# Altium schematic sheet 7.RK3588_DDR_Controler.SchDoc
size A3; SheetNumber: 7; SheetTotal: 21
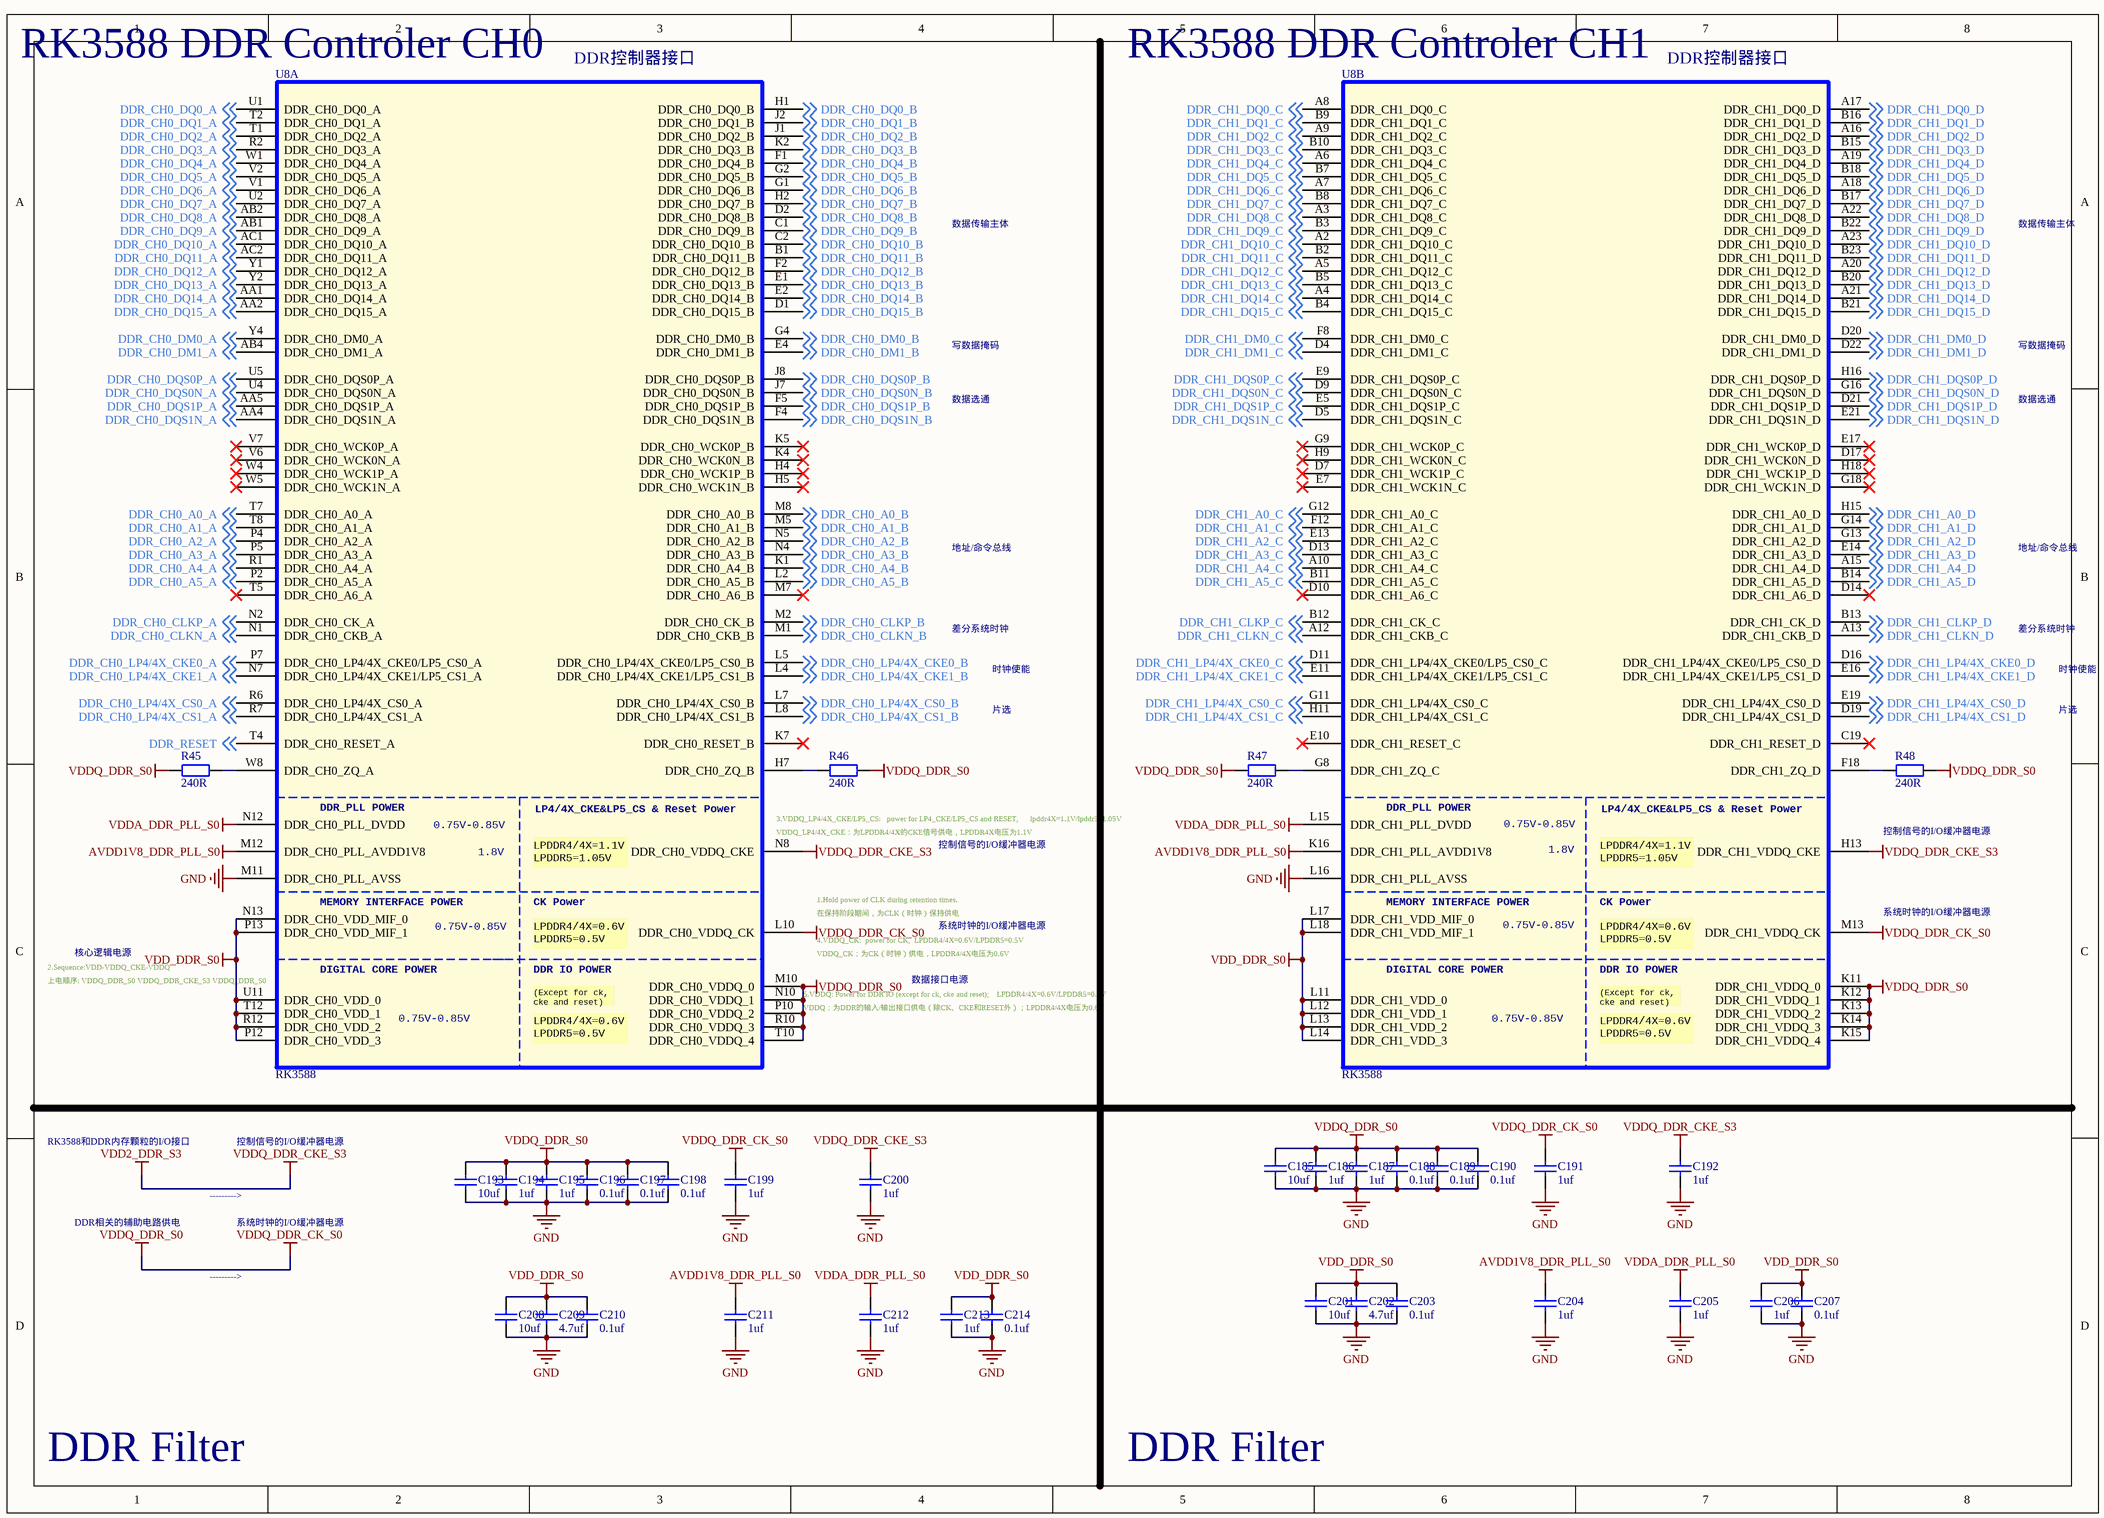
[diagram p0: 7.RK3588_DDR_Controler.SchDoc]

## Parts
C185  10uf  [C0402_L]
C186  1uf  [C0201_L]
C187  1uf  [C0201_L]
C188  0.1uf  [C0201_L]
C189  0.1uf  [C0201_L]
C190  0.1uf  [C0201_L]
C191  1uf  [C0201_L]
C192  1uf  [C0201_L]
C193  10uf  [C0402_L]
C194  1uf  [C0201_L]
C195  1uf  [C0201_L]
C196  0.1uf  [C0201_L]
C197  0.1uf  [C0201_L]
C198  0.1uf  [C0201_L]
C199  1uf  [C0201_L]
C200  1uf  [C0201_L]
C201  10uf  [C0402_L]
C202  4.7uf  [C0201_L]
C203  0.1uf  [C0201_L]
C204  1uf  [C0201_L]
C205  1uf  [C0201_L]
C206  1uf  [C0201_L]
C207  0.1uf  [C0201_L]
C208  10uf  [C0201_L]
C209  4.7uf  [C0201_L]
C210  0.1uf  [C0201_L]
C211  1uf  [C0201_L]
C212  1uf  [C0201_L]
C213  1uf  [C0201_L]
C214  0.1uf  [C0201_L]
R45  240R  [R0201_L]
R46  240R  [R0201_L]
R47  240R  [R0201_L]
R48  240R  [R0201_L]
U8  RK3588  [BGA1088_23R00X23R00X2R00]  (parts A,B of 26)

## Nets
AVDD1V8_DDR_PLL_S0: C204.2 C211.2 U8.K16(DDR_CH1_PLL_AVDD1V8) U8.M12(DDR_CH0_PLL_AVDD1V8)
GND: C185.1 C186.1 C187.1 C188.1 C189.1 C190.1 C191.1 C192.1 C193.1 C194.1 C195.1 C196.1 C197.1 C198.1 C199.1 C200.1 C201.1 C202.1 C203.1 C204.1 C205.1 C206.1 C207.1 C208.1 C209.1 C210.1 C211.1 C212.1 C213.1 C214.1 U8.L16(DDR_CH1_PLL_AVSS) U8.M11(DDR_CH0_PLL_AVSS)
VDD2_DDR_S3: C192.2 C200.2 U8.H13(DDR_CH1_VDDQ_CKE) U8.N8(DDR_CH0_VDDQ_CKE)  [also labelled VDDQ_DDR_CKE_S3]
VDD_DDR_S0: C201.2 C202.2 C203.2 C206.2 C207.2 C208.2 C209.2 C210.2 C213.2 C214.2 U8.L11(DDR_CH1_VDD_0) U8.L12(DDR_CH1_VDD_1) U8.L13(DDR_CH1_VDD_2) U8.L14(DDR_CH1_VDD_3) U8.L17(DDR_CH1_VDD_MIF_0) U8.L18(DDR_CH1_VDD_MIF_1) U8.N13(DDR_CH0_VDD_MIF_0) U8.P12(DDR_CH0_VDD_3) U8.P13(DDR_CH0_VDD_MIF_1) U8.R12(DDR_CH0_VDD_2) U8.T12(DDR_CH0_VDD_1) U8.U11(DDR_CH0_VDD_0)
VDDA_DDR_PLL_S0: C205.2 C212.2 U8.L15(DDR_CH1_PLL_DVDD) U8.N12(DDR_CH0_PLL_DVDD)
VDDQ_DDR_CK_S0: C185.2 C186.2 C187.2 C188.2 C189.2 C190.2 C191.2 C193.2 C194.2 C195.2 C196.2 C197.2 C198.2 C199.2 R45.1 R46.1 R47.1 R48.1 U8.K11(DDR_CH1_VDDQ_0) U8.K12(DDR_CH1_VDDQ_1) U8.K13(DDR_CH1_VDDQ_2) U8.K14(DDR_CH1_VDDQ_3) U8.K15(DDR_CH1_VDDQ_4) U8.L10(DDR_CH0_VDDQ_CK) U8.M10(DDR_CH0_VDDQ_0) U8.M13(DDR_CH1_VDDQ_CK) U8.N10(DDR_CH0_VDDQ_1) U8.P10(DDR_CH0_VDDQ_2) U8.R10(DDR_CH0_VDDQ_3) U8.T10(DDR_CH0_VDDQ_4)  [also labelled VDDQ_DDR_S0]
DDR_CH0_A0_A: U8.T7(DDR_CH0_A0_A) ; off-sheet DDR_CH0_A0_A
DDR_CH0_A0_B: U8.M8(DDR_CH0_A0_B) ; off-sheet DDR_CH0_A0_B
DDR_CH0_A1_A: U8.T8(DDR_CH0_A1_A) ; off-sheet DDR_CH0_A1_A
DDR_CH0_A1_B: U8.M5(DDR_CH0_A1_B) ; off-sheet DDR_CH0_A1_B
DDR_CH0_A2_A: U8.P4(DDR_CH0_A2_A) ; off-sheet DDR_CH0_A2_A
DDR_CH0_A2_B: U8.N5(DDR_CH0_A2_B) ; off-sheet DDR_CH0_A2_B
DDR_CH0_A3_A: U8.P5(DDR_CH0_A3_A) ; off-sheet DDR_CH0_A3_A
DDR_CH0_A3_B: U8.N4(DDR_CH0_A3_B) ; off-sheet DDR_CH0_A3_B
DDR_CH0_A4_A: U8.R1(DDR_CH0_A4_A) ; off-sheet DDR_CH0_A4_A
DDR_CH0_A4_B: U8.K1(DDR_CH0_A4_B) ; off-sheet DDR_CH0_A4_B
DDR_CH0_A5_A: U8.P2(DDR_CH0_A5_A) ; off-sheet DDR_CH0_A5_A
DDR_CH0_A5_B: U8.L2(DDR_CH0_A5_B) ; off-sheet DDR_CH0_A5_B
DDR_CH0_CLKN_A: U8.N1(DDR_CH0_CKB_A) ; off-sheet DDR_CH0_CLKN_A
DDR_CH0_CLKN_B: U8.M1(DDR_CH0_CKB_B) ; off-sheet DDR_CH0_CLKN_B
DDR_CH0_CLKP_A: U8.N2(DDR_CH0_CK_A) ; off-sheet DDR_CH0_CLKP_A
DDR_CH0_CLKP_B: U8.M2(DDR_CH0_CK_B) ; off-sheet DDR_CH0_CLKP_B
DDR_CH0_DM0_A: U8.Y4(DDR_CH0_DM0_A) ; off-sheet DDR_CH0_DM0_A
DDR_CH0_DM0_B: U8.G4(DDR_CH0_DM0_B) ; off-sheet DDR_CH0_DM0_B
DDR_CH0_DM1_A: U8.AB4(DDR_CH0_DM1_A) ; off-sheet DDR_CH0_DM1_A
DDR_CH0_DM1_B: U8.E4(DDR_CH0_DM1_B) ; off-sheet DDR_CH0_DM1_B
DDR_CH0_DQ0_A: U8.U1(DDR_CH0_DQ0_A) ; off-sheet DDR_CH0_DQ0_A
DDR_CH0_DQ0_B: U8.H1(DDR_CH0_DQ0_B) ; off-sheet DDR_CH0_DQ0_B
DDR_CH0_DQ1_A: U8.T2(DDR_CH0_DQ1_A) ; off-sheet DDR_CH0_DQ1_A
DDR_CH0_DQ1_B: U8.J2(DDR_CH0_DQ1_B) ; off-sheet DDR_CH0_DQ1_B
DDR_CH0_DQ2_A: U8.T1(DDR_CH0_DQ2_A) ; off-sheet DDR_CH0_DQ2_A
DDR_CH0_DQ2_B: U8.J1(DDR_CH0_DQ2_B) ; off-sheet DDR_CH0_DQ2_B
DDR_CH0_DQ3_A: U8.R2(DDR_CH0_DQ3_A) ; off-sheet DDR_CH0_DQ3_A
DDR_CH0_DQ3_B: U8.K2(DDR_CH0_DQ3_B) ; off-sheet DDR_CH0_DQ3_B
DDR_CH0_DQ4_A: U8.W1(DDR_CH0_DQ4_A) ; off-sheet DDR_CH0_DQ4_A
DDR_CH0_DQ4_B: U8.F1(DDR_CH0_DQ4_B) ; off-sheet DDR_CH0_DQ4_B
DDR_CH0_DQ5_A: U8.V2(DDR_CH0_DQ5_A) ; off-sheet DDR_CH0_DQ5_A
DDR_CH0_DQ5_B: U8.G2(DDR_CH0_DQ5_B) ; off-sheet DDR_CH0_DQ5_B
DDR_CH0_DQ6_A: U8.V1(DDR_CH0_DQ6_A) ; off-sheet DDR_CH0_DQ6_A
DDR_CH0_DQ6_B: U8.G1(DDR_CH0_DQ6_B) ; off-sheet DDR_CH0_DQ6_B
DDR_CH0_DQ7_A: U8.U2(DDR_CH0_DQ7_A) ; off-sheet DDR_CH0_DQ7_A
DDR_CH0_DQ7_B: U8.H2(DDR_CH0_DQ7_B) ; off-sheet DDR_CH0_DQ7_B
DDR_CH0_DQ8_A: U8.AB2(DDR_CH0_DQ8_A) ; off-sheet DDR_CH0_DQ8_A
DDR_CH0_DQ8_B: U8.D2(DDR_CH0_DQ8_B) ; off-sheet DDR_CH0_DQ8_B
DDR_CH0_DQ9_A: U8.AB1(DDR_CH0_DQ9_A) ; off-sheet DDR_CH0_DQ9_A
DDR_CH0_DQ9_B: U8.C1(DDR_CH0_DQ9_B) ; off-sheet DDR_CH0_DQ9_B
DDR_CH0_DQ10_A: U8.AC1(DDR_CH0_DQ10_A) ; off-sheet DDR_CH0_DQ10_A
DDR_CH0_DQ10_B: U8.C2(DDR_CH0_DQ10_B) ; off-sheet DDR_CH0_DQ10_B
DDR_CH0_DQ11_A: U8.AC2(DDR_CH0_DQ11_A) ; off-sheet DDR_CH0_DQ11_A
DDR_CH0_DQ11_B: U8.B1(DDR_CH0_DQ11_B) ; off-sheet DDR_CH0_DQ11_B
DDR_CH0_DQ12_A: U8.Y1(DDR_CH0_DQ12_A) ; off-sheet DDR_CH0_DQ12_A
DDR_CH0_DQ12_B: U8.F2(DDR_CH0_DQ12_B) ; off-sheet DDR_CH0_DQ12_B
DDR_CH0_DQ13_A: U8.Y2(DDR_CH0_DQ13_A) ; off-sheet DDR_CH0_DQ13_A
DDR_CH0_DQ13_B: U8.E1(DDR_CH0_DQ13_B) ; off-sheet DDR_CH0_DQ13_B
DDR_CH0_DQ14_A: U8.AA1(DDR_CH0_DQ14_A) ; off-sheet DDR_CH0_DQ14_A
DDR_CH0_DQ14_B: U8.E2(DDR_CH0_DQ14_B) ; off-sheet DDR_CH0_DQ14_B
DDR_CH0_DQ15_A: U8.AA2(DDR_CH0_DQ15_A) ; off-sheet DDR_CH0_DQ15_A
DDR_CH0_DQ15_B: U8.D1(DDR_CH0_DQ15_B) ; off-sheet DDR_CH0_DQ15_B
DDR_CH0_DQS0N_A: U8.U4(DDR_CH0_DQS0N_A) ; off-sheet DDR_CH0_DQS0N_A
DDR_CH0_DQS0N_B: U8.J7(DDR_CH0_DQS0N_B) ; off-sheet DDR_CH0_DQS0N_B
DDR_CH0_DQS0P_A: U8.U5(DDR_CH0_DQS0P_A) ; off-sheet DDR_CH0_DQS0P_A
DDR_CH0_DQS0P_B: U8.J8(DDR_CH0_DQS0P_B) ; off-sheet DDR_CH0_DQS0P_B
DDR_CH0_DQS1N_A: U8.AA4(DDR_CH0_DQS1N_A) ; off-sheet DDR_CH0_DQS1N_A
DDR_CH0_DQS1N_B: U8.F4(DDR_CH0_DQS1N_B) ; off-sheet DDR_CH0_DQS1N_B
DDR_CH0_DQS1P_A: U8.AA5(DDR_CH0_DQS1P_A) ; off-sheet DDR_CH0_DQS1P_A
DDR_CH0_DQS1P_B: U8.F5(DDR_CH0_DQS1P_B) ; off-sheet DDR_CH0_DQS1P_B
DDR_CH0_LP4/4X_CKE0_A: U8.P7(DDR_CH0_LP4/4X_CKE0/LP5_CS0_A) ; off-sheet DDR_CH0_LP4/4X_CKE0_A
DDR_CH0_LP4/4X_CKE0_B: U8.L5(DDR_CH0_LP4/4X_CKE0/LP5_CS0_B) ; off-sheet DDR_CH0_LP4/4X_CKE0_B
DDR_CH0_LP4/4X_CKE1_A: U8.N7(DDR_CH0_LP4/4X_CKE1/LP5_CS1_A) ; off-sheet DDR_CH0_LP4/4X_CKE1_A
DDR_CH0_LP4/4X_CKE1_B: U8.L4(DDR_CH0_LP4/4X_CKE1/LP5_CS1_B) ; off-sheet DDR_CH0_LP4/4X_CKE1_B
DDR_CH0_LP4/4X_CS0_A: U8.R6(DDR_CH0_LP4/4X_CS0_A) ; off-sheet DDR_CH0_LP4/4X_CS0_A
DDR_CH0_LP4/4X_CS0_B: U8.L7(DDR_CH0_LP4/4X_CS0_B) ; off-sheet DDR_CH0_LP4/4X_CS0_B
DDR_CH0_LP4/4X_CS1_A: U8.R7(DDR_CH0_LP4/4X_CS1_A) ; off-sheet DDR_CH0_LP4/4X_CS1_A
DDR_CH0_LP4/4X_CS1_B: U8.L8(DDR_CH0_LP4/4X_CS1_B) ; off-sheet DDR_CH0_LP4/4X_CS1_B
DDR_CH1_A0_C: U8.G12(DDR_CH1_A0_C) ; off-sheet DDR_CH1_A0_C
DDR_CH1_A0_D: U8.H15(DDR_CH1_A0_D) ; off-sheet DDR_CH1_A0_D
DDR_CH1_A1_C: U8.F12(DDR_CH1_A1_C) ; off-sheet DDR_CH1_A1_C
DDR_CH1_A1_D: U8.G14(DDR_CH1_A1_D) ; off-sheet DDR_CH1_A1_D
DDR_CH1_A2_C: U8.E13(DDR_CH1_A2_C) ; off-sheet DDR_CH1_A2_C
DDR_CH1_A2_D: U8.G13(DDR_CH1_A2_D) ; off-sheet DDR_CH1_A2_D
DDR_CH1_A3_C: U8.D13(DDR_CH1_A3_C) ; off-sheet DDR_CH1_A3_C
DDR_CH1_A3_D: U8.E14(DDR_CH1_A3_D) ; off-sheet DDR_CH1_A3_D
DDR_CH1_A4_C: U8.A10(DDR_CH1_A4_C) ; off-sheet DDR_CH1_A4_C
DDR_CH1_A4_D: U8.A15(DDR_CH1_A4_D) ; off-sheet DDR_CH1_A4_D
DDR_CH1_A5_C: U8.B11(DDR_CH1_A5_C) ; off-sheet DDR_CH1_A5_C
DDR_CH1_A5_D: U8.B14(DDR_CH1_A5_D) ; off-sheet DDR_CH1_A5_D
DDR_CH1_CLKN_C: U8.A12(DDR_CH1_CKB_C) ; off-sheet DDR_CH1_CLKN_C
DDR_CH1_CLKN_D: U8.A13(DDR_CH1_CKB_D) ; off-sheet DDR_CH1_CLKN_D
DDR_CH1_CLKP_C: U8.B12(DDR_CH1_CK_C) ; off-sheet DDR_CH1_CLKP_C
DDR_CH1_CLKP_D: U8.B13(DDR_CH1_CK_D) ; off-sheet DDR_CH1_CLKP_D
DDR_CH1_DM0_C: U8.F8(DDR_CH1_DM0_C) ; off-sheet DDR_CH1_DM0_C
DDR_CH1_DM0_D: U8.D20(DDR_CH1_DM0_D) ; off-sheet DDR_CH1_DM0_D
DDR_CH1_DM1_C: U8.D4(DDR_CH1_DM1_C) ; off-sheet DDR_CH1_DM1_C
DDR_CH1_DM1_D: U8.D22(DDR_CH1_DM1_D) ; off-sheet DDR_CH1_DM1_D
DDR_CH1_DQ0_C: U8.A8(DDR_CH1_DQ0_C) ; off-sheet DDR_CH1_DQ0_C
DDR_CH1_DQ0_D: U8.A17(DDR_CH1_DQ0_D) ; off-sheet DDR_CH1_DQ0_D
DDR_CH1_DQ1_C: U8.B9(DDR_CH1_DQ1_C) ; off-sheet DDR_CH1_DQ1_C
DDR_CH1_DQ1_D: U8.B16(DDR_CH1_DQ1_D) ; off-sheet DDR_CH1_DQ1_D
DDR_CH1_DQ2_C: U8.A9(DDR_CH1_DQ2_C) ; off-sheet DDR_CH1_DQ2_C
DDR_CH1_DQ2_D: U8.A16(DDR_CH1_DQ2_D) ; off-sheet DDR_CH1_DQ2_D
DDR_CH1_DQ3_C: U8.B10(DDR_CH1_DQ3_C) ; off-sheet DDR_CH1_DQ3_C
DDR_CH1_DQ3_D: U8.B15(DDR_CH1_DQ3_D) ; off-sheet DDR_CH1_DQ3_D
DDR_CH1_DQ4_C: U8.A6(DDR_CH1_DQ4_C) ; off-sheet DDR_CH1_DQ4_C
DDR_CH1_DQ4_D: U8.A19(DDR_CH1_DQ4_D) ; off-sheet DDR_CH1_DQ4_D
DDR_CH1_DQ5_C: U8.B7(DDR_CH1_DQ5_C) ; off-sheet DDR_CH1_DQ5_C
DDR_CH1_DQ5_D: U8.B18(DDR_CH1_DQ5_D) ; off-sheet DDR_CH1_DQ5_D
DDR_CH1_DQ6_C: U8.A7(DDR_CH1_DQ6_C) ; off-sheet DDR_CH1_DQ6_C
DDR_CH1_DQ6_D: U8.A18(DDR_CH1_DQ6_D) ; off-sheet DDR_CH1_DQ6_D
DDR_CH1_DQ7_C: U8.B8(DDR_CH1_DQ7_C) ; off-sheet DDR_CH1_DQ7_C
DDR_CH1_DQ7_D: U8.B17(DDR_CH1_DQ7_D) ; off-sheet DDR_CH1_DQ7_D
DDR_CH1_DQ8_C: U8.A3(DDR_CH1_DQ8_C) ; off-sheet DDR_CH1_DQ8_C
DDR_CH1_DQ8_D: U8.A22(DDR_CH1_DQ8_D) ; off-sheet DDR_CH1_DQ8_D
DDR_CH1_DQ9_C: U8.B3(DDR_CH1_DQ9_C) ; off-sheet DDR_CH1_DQ9_C
DDR_CH1_DQ9_D: U8.B22(DDR_CH1_DQ9_D) ; off-sheet DDR_CH1_DQ9_D
DDR_CH1_DQ10_C: U8.A2(DDR_CH1_DQ10_C) ; off-sheet DDR_CH1_DQ10_C
DDR_CH1_DQ10_D: U8.A23(DDR_CH1_DQ10_D) ; off-sheet DDR_CH1_DQ10_D
DDR_CH1_DQ11_C: U8.B2(DDR_CH1_DQ11_C) ; off-sheet DDR_CH1_DQ11_C
DDR_CH1_DQ11_D: U8.B23(DDR_CH1_DQ11_D) ; off-sheet DDR_CH1_DQ11_D
DDR_CH1_DQ12_C: U8.A5(DDR_CH1_DQ12_C) ; off-sheet DDR_CH1_DQ12_C
DDR_CH1_DQ12_D: U8.A20(DDR_CH1_DQ12_D) ; off-sheet DDR_CH1_DQ12_D
DDR_CH1_DQ13_C: U8.B5(DDR_CH1_DQ13_C) ; off-sheet DDR_CH1_DQ13_C
DDR_CH1_DQ13_D: U8.B20(DDR_CH1_DQ13_D) ; off-sheet DDR_CH1_DQ13_D
DDR_CH1_DQ14_C: U8.A4(DDR_CH1_DQ14_C) ; off-sheet DDR_CH1_DQ14_C
DDR_CH1_DQ14_D: U8.A21(DDR_CH1_DQ14_D) ; off-sheet DDR_CH1_DQ14_D
DDR_CH1_DQ15_C: U8.B4(DDR_CH1_DQ15_C) ; off-sheet DDR_CH1_DQ15_C
DDR_CH1_DQ15_D: U8.B21(DDR_CH1_DQ15_D) ; off-sheet DDR_CH1_DQ15_D
DDR_CH1_DQS0N_C: U8.D9(DDR_CH1_DQS0N_C) ; off-sheet DDR_CH1_DQS0N_C
DDR_CH1_DQS0N_D: U8.G16(DDR_CH1_DQS0N_D) ; off-sheet DDR_CH1_DQS0N_D
DDR_CH1_DQS0P_C: U8.E9(DDR_CH1_DQS0P_C) ; off-sheet DDR_CH1_DQS0P_C
DDR_CH1_DQS0P_D: U8.H16(DDR_CH1_DQS0P_D) ; off-sheet DDR_CH1_DQS0P_D
DDR_CH1_DQS1N_C: U8.D5(DDR_CH1_DQS1N_C) ; off-sheet DDR_CH1_DQS1N_C
DDR_CH1_DQS1N_D: U8.E21(DDR_CH1_DQS1N_D) ; off-sheet DDR_CH1_DQS1N_D
DDR_CH1_DQS1P_C: U8.E5(DDR_CH1_DQS1P_C) ; off-sheet DDR_CH1_DQS1P_C
DDR_CH1_DQS1P_D: U8.D21(DDR_CH1_DQS1P_D) ; off-sheet DDR_CH1_DQS1P_D
DDR_CH1_LP4/4X_CKE0_C: U8.D11(DDR_CH1_LP4/4X_CKE0/LP5_CS0_C) ; off-sheet DDR_CH1_LP4/4X_CKE0_C
DDR_CH1_LP4/4X_CKE0_D: U8.D16(DDR_CH1_LP4/4X_CKE0/LP5_CS0_D) ; off-sheet DDR_CH1_LP4/4X_CKE0_D
DDR_CH1_LP4/4X_CKE1_C: U8.E11(DDR_CH1_LP4/4X_CKE1/LP5_CS1_C) ; off-sheet DDR_CH1_LP4/4X_CKE1_C
DDR_CH1_LP4/4X_CKE1_D: U8.E16(DDR_CH1_LP4/4X_CKE1/LP5_CS1_D) ; off-sheet DDR_CH1_LP4/4X_CKE1_D
DDR_CH1_LP4/4X_CS0_C: U8.G11(DDR_CH1_LP4/4X_CS0_C) ; off-sheet DDR_CH1_LP4/4X_CS0_C
DDR_CH1_LP4/4X_CS0_D: U8.E19(DDR_CH1_LP4/4X_CS0_D) ; off-sheet DDR_CH1_LP4/4X_CS0_D
DDR_CH1_LP4/4X_CS1_C: U8.H11(DDR_CH1_LP4/4X_CS1_C) ; off-sheet DDR_CH1_LP4/4X_CS1_C
DDR_CH1_LP4/4X_CS1_D: U8.D19(DDR_CH1_LP4/4X_CS1_D) ; off-sheet DDR_CH1_LP4/4X_CS1_D
DDR_RESET: U8.T4(DDR_CH0_RESET_A) ; off-sheet DDR_RESET
NetR45_2: R45.2 U8.W8(DDR_CH0_ZQ_A)
NetR46_2: R46.2 U8.H7(DDR_CH0_ZQ_B)
NetR47_2: R47.2 U8.G8(DDR_CH1_ZQ_C)
NetR48_2: R48.2 U8.F18(DDR_CH1_ZQ_D)

Not connected (* = marked no-connect by the designer): U8 C19(DDR_CH1_RESET_D)* D7(DDR_CH1_WCK1P_C)* D10(DDR_CH1_A6_C)* D14(DDR_CH1_A6_D)* D17(DDR_CH1_WCK0N_D)* E7(DDR_CH1_WCK1N_C)* E10(DDR_CH1_RESET_C)* E17(DDR_CH1_WCK0P_D)* G9(DDR_CH1_WCK0P_C)* G18(DDR_CH1_WCK1N_D)* H4(DDR_CH0_WCK1P_B)* H5(DDR_CH0_WCK1N_B)* H9(DDR_CH1_WCK0N_C)* H18(DDR_CH1_WCK1P_D)* K4(DDR_CH0_WCK0N_B)* K5(DDR_CH0_WCK0P_B)* K7(DDR_CH0_RESET_B)* M7(DDR_CH0_A6_B)* T5(DDR_CH0_A6_A)* V6(DDR_CH0_WCK0N_A)* V7(DDR_CH0_WCK0P_A)* W4(DDR_CH0_WCK1P_A)* W5(DDR_CH0_WCK1N_A)*

## Notes on the sheet
- (near U8) RK3588 DDR Controler CH0
- (near U8) DDR控制器接口
- (near U8) RK3588 DDR Controler CH1
- 数据传输主体
- 写数据掩码
- 数据选通
- 地址/命令总线
- 差分系统时钟
- 时钟使能
- 片选
- (near U8) 3.VDDQ_LP4/4X_CKE/LP5_CS:   power for LP4_CKE/LP5_CS and RESET,      lpddr4X=1.1V/lpddr5=1.05V
- (near U8) VDDQ_LP4/4X_CKE：为LPDDR4/4X的CKE信号供电，LPDDR4X电压为1.1V
- 控制信号的I/O缓冲器电源
- 1.Hold power of CLK during retention times.
- 在保持阶段期间，为CLK（时钟）保持供电
- 系统时钟的I/O缓冲器电源
- 上电顺序: VDDQ_DDR_S0 VDDQ_DDR_CKE_S3 VDDQ_DDR_S0
- 2.Sequence:VDD-VDDQ_CKE-VDDQ
- 核心逻辑电源
- (near U8) 5.VDDQ: Power for DDR IO (except for ck, cke and reset);    LPDDR4/4X=0.6V/LPDDR5=0.5V
- 4.VDDQ_CK:  power for CK,  LPDDR4/4X=0.6V/LPDDR5=0.5V
- VDDQ_CK：为CK（时钟）供电，LPDDR4/4X电压为0.6V
- 数据接口电源
- (near U8) VDDQ：为DDR的输入/输出接口供电（除CK、CKE和RESET外）；LPDDR4/4X电压为0.6V
- RK3588和DDR内存颗粒的I/O接口
- --------->
- DDR相关的辅助电路供电
- DDR Filter
- (in symbol SOC_RK3588, part A) DDR_PLL POWER; LP4/4X_CKE&LP5_CS & Reset Power; 0.75V-0.85V; 1.8V; LPDDR4/4X=1.1V / LPDDR5=1.05V; MEMORY INTERFACE POWER; CK Power; LPDDR4/4X=0.6V / LPDDR5=0.5V; DIGITAL CORE POWER; DDR IO POWER; (Except for ck, / cke and reset)
- (in symbol SOC_RK3588, part B) DDR_PLL POWER; LP4/4X_CKE&LP5_CS & Reset Power; 0.75V-0.85V; 1.8V; LPDDR4/4X=1.1V / LPDDR5=1.05V; MEMORY INTERFACE POWER; CK Power; LPDDR4/4X=0.6V / LPDDR5=0.5V; DIGITAL CORE POWER; DDR IO POWER; (Except for ck, / cke and reset)

## Library data of the parts
C185-C214 = C: 贴片电容/MLCC电容
R45-R48 = R: 贴片电阻
U8 = SOC_RK3588: ROCKCHIP SOC